# Altium project DeskDigitalClock.PrjPcb
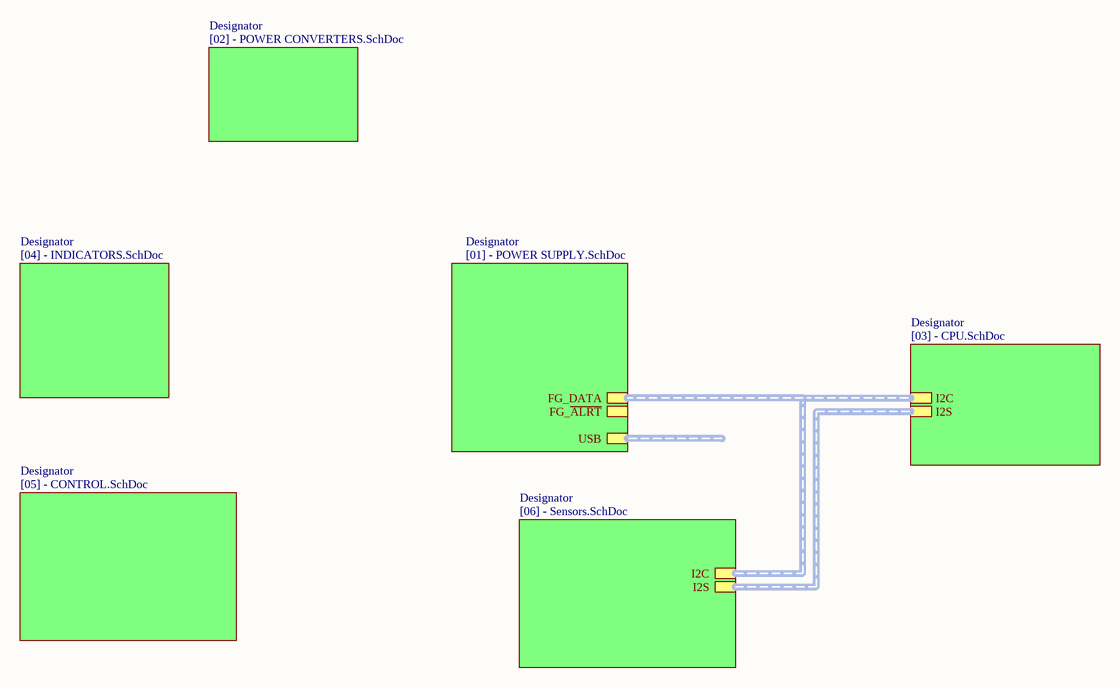
[diagram p0: [00] - BLOCK DIAGRAM.SchDoc]
7 sheets, 120 parts. Net scope: hierarchical (ports join the sheet entries above them; power ports are global).
Board file: DeskDigitalClock.PcbDoc
Sheets:
  [00] - BLOCK DIAGRAM.SchDoc
    Designator = [01] - POWER SUPPLY.SchDoc
    Designator = [02] - POWER CONVERTERS.SchDoc
    Designator = [03] - CPU.SchDoc
    Designator = [04] - INDICATORS.SchDoc
    Designator = [05] - CONTROL.SchDoc
    Designator = [06] - SENSORS.SchDoc

## Sheet [00] - BLOCK DIAGRAM.SchDoc: Desk Digital Clock
size A4; DrawnBy: Ramil Teregulov; Address1: https://github.com/teregulov; Address2: https://github.com/teregulov/Desk-Digital-Clock; DocumentNumber: DDC-1; Revision: 1R0; SheetNumber: 1; SheetTotal: 7

### Sub-sheets
Designator = [01] - POWER SUPPLY.SchDoc: FG_DATA, FG_~{ALRT}, USB
Designator = [02] - POWER CONVERTERS.SchDoc: no entries
Designator = [03] - CPU.SchDoc: I2C, I2S
Designator = [04] - INDICATORS.SchDoc: no entries
Designator = [05] - CONTROL.SchDoc: no entries
Designator = [06] - Sensors.SchDoc: I2C, I2S

### Buses and harness runs
harness sheet Designator/FG_DATA = sheet Designator/I2C

### Notes on the sheet
- Title:
- Size:
- Date:
- A4
- Number:
- Time:
- Revision:
- Sheet
- of
- File:

## Sheet [01] - POWER SUPPLY.SchDoc: Desk Digital Clock
size A2; DrawnBy: Ramil Teregulov; Address1: http://github.com/teregulov; Address2: http://github.com/teregulov/Desk-Digital-Clock; DocumentNumber: DDC-5; Revision: 1R0; SheetNumber: 5; SheetTotal: 7
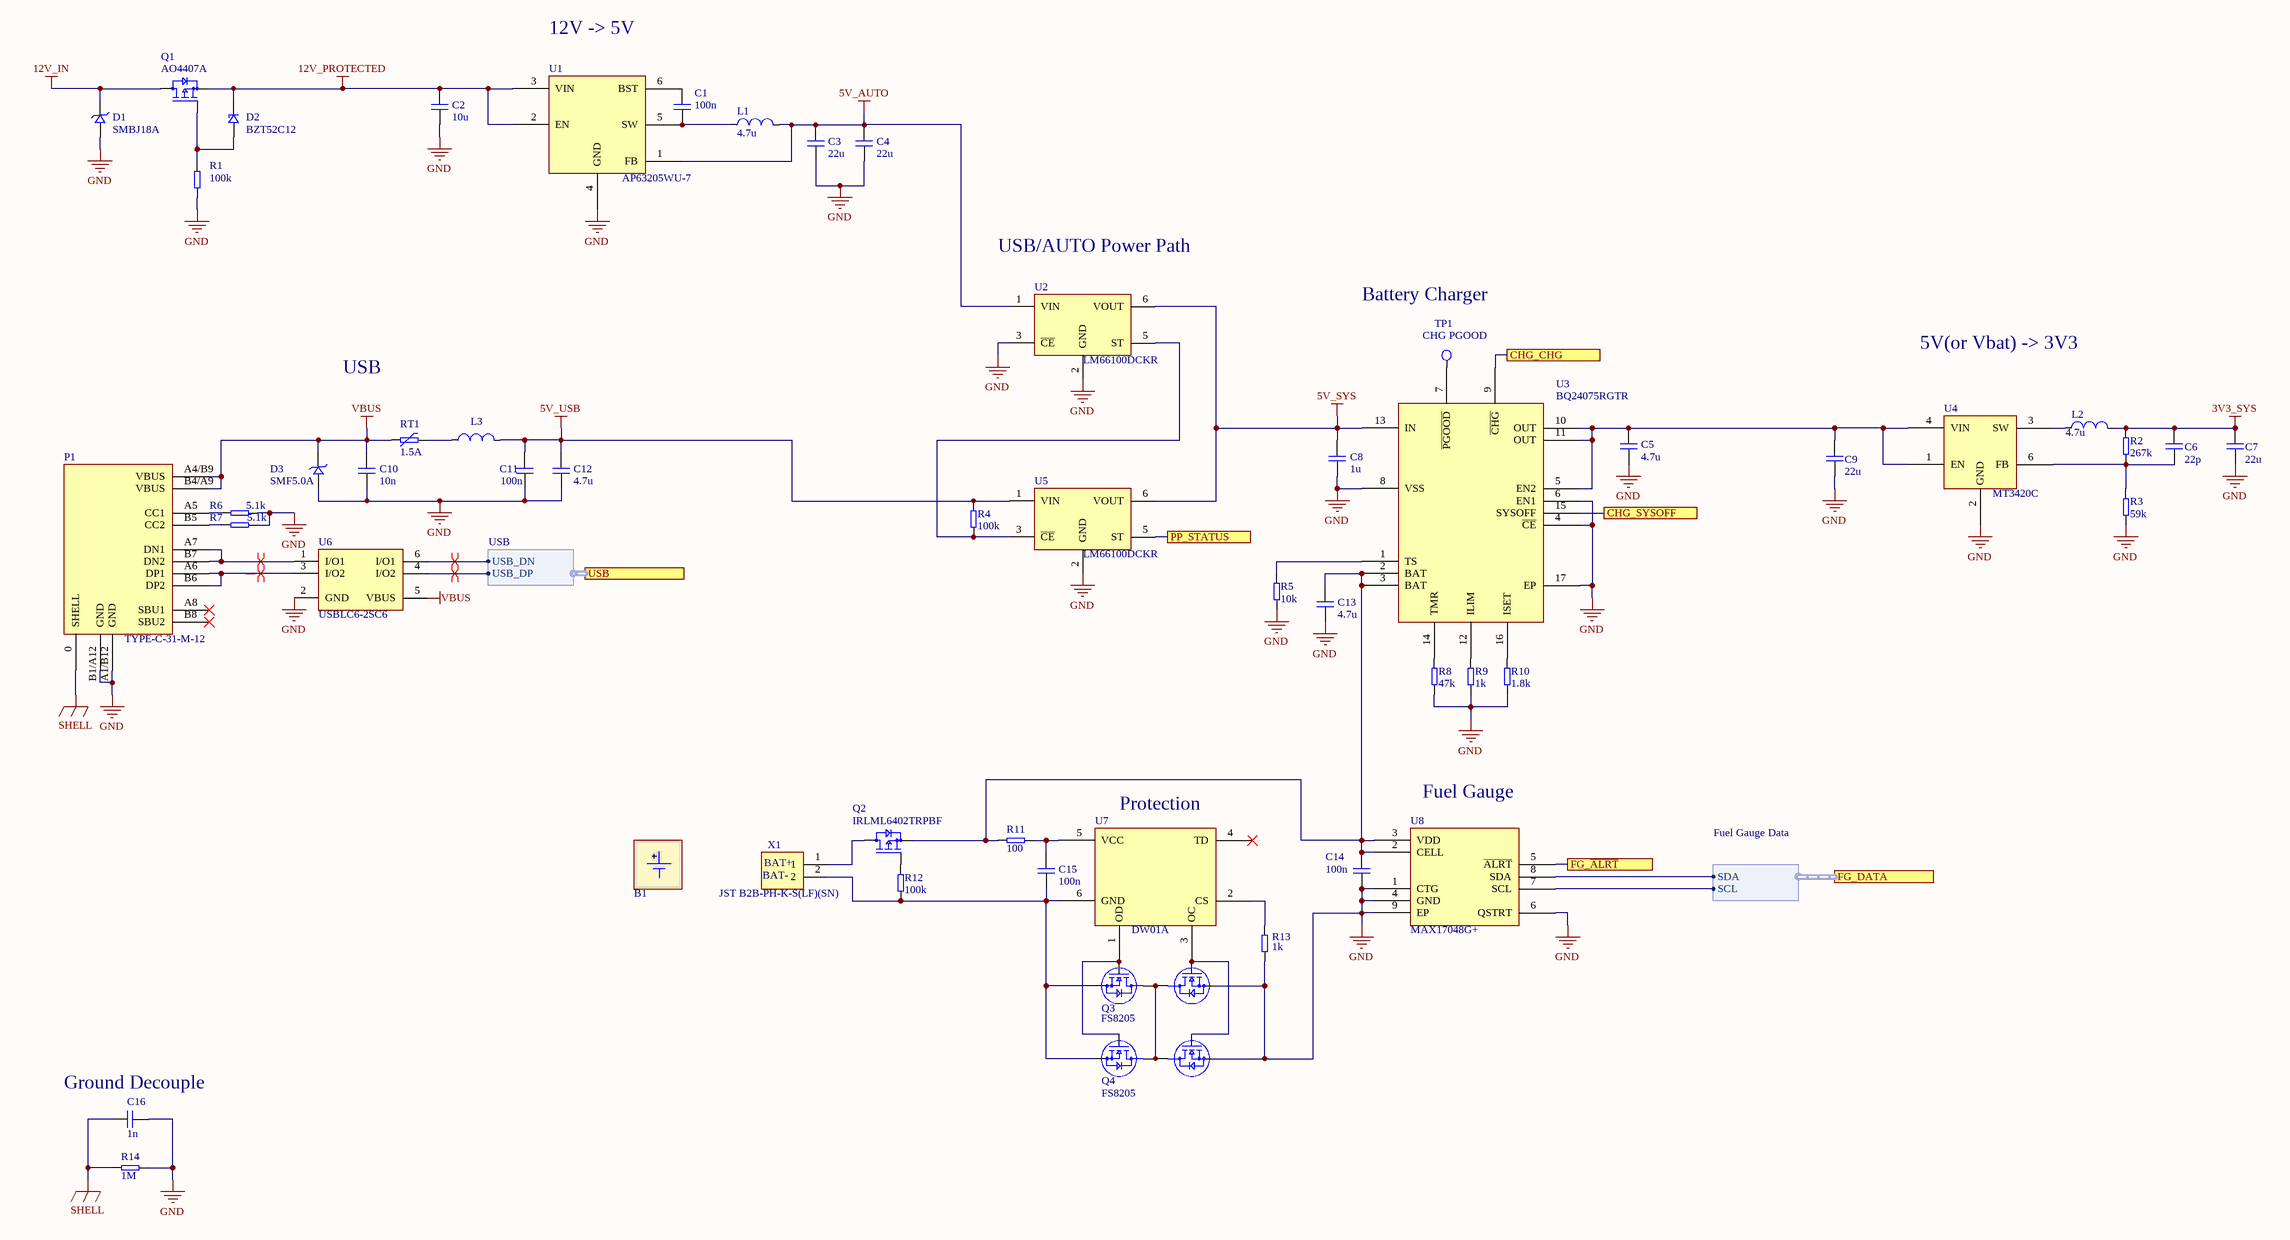
[diagram p1: [01] - POWER SUPPLY.SchDoc]

### Parts
(Parts that share a designator on the sheet are numbered #1, #2 ... from top to bottom, then left to right.)
B1  (no value)  (mechanical)
C1  100n  [C0603]
C2  10u  [C1206]
C3  22u  [C1206]
C4  22u  [C1206]
C5  4.7u  [C0603]
C6  22p  [C0603]
C7  22u  [C1210]
C8  1u  [C0603]
C9  22u  [C1210]
C10  10n  [C0603]
C11  100n  [C0603]
C12  4.7u  [C0603]
C13  4.7u  [C0603]
C14  100n  [C0603]
C15  100n  [C0603]
C16#1  1n  [C0603]
D1  SMBJ18A  [SMBJ18A]
D2#1  BZT52C12  [BZT52C12]
D3#1  SMF5.0A  [SSMF5.0A OD-123FL]
L1#1  4.7u  [GSM0530-xxx-M Inductor]
L2  4.7u  [CDRH5D16]
L3  (no value)  [C0805]
P1  TYPE-C-31-M-12  [TYPE-C-31-M-12]
Q1  AO4407A  [UMW AO4407A]
Q2  IRLML6402TRPBF  [IRLML6402TRPBF]
Q3  FS8205  [SOT23-6-MT3420C]
Q4  FS8205  [SOT23-6-MT3420C]
R1  100k  [R0603]
R2  267k  [R0603]
R3  59k  [R0603]
R4  100k  [R0603]
R5  10k  [R0603]
R6  5.1k  [R0603]
R7  5.1k  [R0603]
R8  47k  [R0603]
R9  1k  [R0603]
R10  1.8k  [R0603]
R11  100  [R0603]
R12  100k  [R0603]
R13  1k  [R0603]
R14  1M  [R0603]
RT1  value 1.5A  [MF-MSMF150]  (hidden comment: MF-MSMF150-2)
TP1  Test Point Name: CHG PGOOD  [Test Point 1.6 mm]  (hidden comment: Test Point)  (no BOM)
U1  AP63205WU-7  [TAP63200/AP63201/AP63203/AP63205 SOT26]
U2  LM66100DCKR  [LM66100DCKR]
U3  BQ24075RGTR  [BQ24072 BQ24073 BQ24074 BQ24075 BQ24079]
U4  MT3420C  [SOT23-6-MT3420C]
U5  LM66100DCKR  [LM66100DCKR]
U6#1  USBLC6-2SC6  [SOT23-6L-USBLC6-2SC6]
U7  DW01A  [SOT23-6-MT3420C]
U8  MAX17048G+  [MAXIM MAX17048G+T10]
X1  JST B2B-PH-K-S(LF)(SN)  [B2B -PH-K-S]

### Ports
CHG_CHG, CHG_SYSOFF, FG_DATA (harness Fuel Gauge Data), FG_~{ALRT}, PP_STATUS, USB (harness USB)

### Harnesses
Fuel Gauge Data: SDA, SCL
USB: USB_DP, USB_DN

### Nets
3V3_SYS: C6.2 C7.2 L2.2 R2.2
5V_AUTO: C3.2 C4.2 L1#1.2 U1.1(FB) U2.1(VIN)
5V_SYS: C8.2 U2.6(VOUT) U3.13(IN) U5.6(VOUT)
5V_USB: C11.2 C12.2 L3.2 R4.1 U5.1(VIN)
12V_IN: D1.1 Q1.D
12V_PROTECTED: C2.2 D2#1.1 Q1.S U1.2(EN) U1.3(VIN)
GND: C2.1 C3.1 C4.1 C5.1 C7.1 C8.1 C9.1 C10.1 C11.1 C12.1 C13.1 C14.1 C16#1.1 D1.2 D3#1.2 P1.A1/B12(GND) P1.B1/A12(GND) Q3.3(S2) Q4.3(S2) R1.2 R3.1 R5.2 R6.1 R7.1 R8.2 R9.2 R10.2 R13.1 R14.2 U1.4(GND) U2.2(GND) U2.3(~{CE}) U3.4(~{CE}) U3.6(EN1) U3.8(VSS) U3.17(EP) U4.2(GND) U5.2(GND) U6#1.2(GND) U8.1(CTG) U8.4(GND) U8.6(QSTRT) U8.9(EP)
SHELL: C16#1.2 P1.0(SHELL) R14.1
VBUS: C10.2 D3#1.1 P1.A4/B9(VBUS) P1.B4/A9(VBUS) RT1.1 U6#1.5(VBUS)
NetC1_1: C1.1 L1#1.1 U1.5(SW)
NetC1_2: C1.2 U1.6(BST)
NetC5_2: C5.2 C9.2 U3.5(EN2) U3.10(OUT) U3.11(OUT) U4.1(EN) U4.4(VIN)
NetC6_1: C6.1 R2.1 R3.2 U4.6(FB)
NetC13_2: C13.2 C14.2 Q2.2 R11.2 U3.2(BAT) U3.3(BAT) U8.2(CELL) U8.3(VDD)
NetC15_1: C15.1 Q3.1(S1) Q4.1(S1) R12.2 U7.6(GND) X1.2
NetC15_2: C15.2 R11.1 U7.5(VCC)
NetD2#1_2: D2#1.2 Q1.G R1.1
NetL2_1: L2.1 U4.3(SW)
NetL3_1: L3.1 RT1.2
NetP1_A5: P1.A5(CC1) R6.2
NetP1_A6: P1.A6(DP1) P1.B6(DP2) U6#1.3(I/O2)
NetP1_A7: P1.A7(DN1) P1.B7(DN2) U6#1.1(I/O1)
NetP1_B5: P1.B5(CC2) R7.2
NetQ2_1: Q2.1 R12.1
NetQ2_3: Q2.3 X1.1
NetQ3_2: Q3.2(D12) Q3.5(D12) Q4.2(D12) Q4.5(D12)
NetQ3_4: Q3.4(G2) Q4.4(G2) U7.3(OC)
NetQ3_6: Q3.6(G1) Q4.6(G1) U7.1(OD)
NetR4_2: R4.2 U2.5(ST) U5.3(~{CE})
NetR5_1: R5.1 U3.1(TS)
NetR8_1: R8.1 U3.14(TMR)
NetR9_1: R9.1 U3.12(ILIM)
NetR10_1: R10.1 U3.16(ISET)
NetR13_2: R13.2 U7.2(CS)
NetR25_1: U8.7(SCL) ; port FG_DATA.SCL
NetR26_1: U8.8(SDA) ; port FG_DATA.SDA
NetTP1_1: TP1.1 U3.7(~{PGOOD})
NetU3_9: U3.9(~{CHG}) ; port CHG_CHG
NetU3_15: U3.15(SYSOFF) ; port CHG_SYSOFF
NetU5_5: U5.5(ST) ; port PP_STATUS
NetU6#1_4: U6#1.4(I/O2) ; port USB.USB_DP
NetU6#1_6: U6#1.6(I/O1) ; port USB.USB_DN
NetU8_5: U8.5(~{ALRT}) ; port FG_~{ALRT}

Not connected (* = marked no-connect by the designer): P1 A8(SBU1)* B8(SBU2)*; U7 4(TD)*

### Layout directives
differential pair: NetP1_A6, NetP1_A7, NetU6#1_4, NetU6#1_6

### Notes on the sheet
- 12V -> 5V
- USB/AUTO Power Path
- Battery Charger
- USB
- 5V(or Vbat) -> 3V3
- (near U7) Protection
- (near U8) Fuel Gauge
- (near X1) BAT-
- (near X1) BAT+
- (near C16#1) Ground Decouple
- Title:
- Size:
- Date:
- A4
- Number:
- Time:
- Revision:
- Sheet
- of
- File:

### Library data of the parts
B1 = Bat: BATTERY
C1-C15 C16#1 = Cap: CAPACITOR
  C1 C11 C14 C15: Value: 100n
  C2: Value: 10u
  C3 C4 C7 C9: Value: 22u
  C5 C12 C13: Value: 4.7u
  C6: Value: 22p
  C8: Value: 1u
  C10: Value: 10n
  C16: Value: 1n
D1 = SMBJ18A: TVS DIODE 18VWM 29.2VC SMB; Manufacturer: Jingdao Microelectronics; HelpURL: https://www.lcsc.com/datasheet/C353379.pdf?spm=wm.sxq.inf.ggs___wm.fly.bg.1.xh&lcsc_vid=EQRaUgBURlNYUgcERQILVVIEQ1gIVldeRllcAwAFQQMxVlNeR1NcUFFVQVVWVDsOAxUeFF5JWBYZEEoKFBINSQcJGk4dAgUUFAk%3D; P/N: SMBJ18A
D2#1 = BZT52C12: DIODE ZENER 12V 500mW SOD-123; Manufacturer: GOODWORK; HelpURL: https://www.lcsc.com/datasheet/C2932744.pdf?spm=wm.sxq.inf.ggs___wm.fly.bg.1.xh&lcsc_vid=EQRaUgBURlNYUgcERQILVVIEQ1gIVldeRllcAwAFQQMxVlNeR1NcUVVQTlheVDsOAxUeFF5JWBYZEEoKFBINSQcJGk4eFQsCAgIaSgADAwAHC0slRVlaVlBeRU8GEwkK; P/N: BZT52C12
D3#1 = SMF5.0A: TVS DIODE 5VWM 9.2VC SOD-123FL; Manufacturer: Littelfuse; HelpURL: https://www.lcsc.com/datasheet/C151296.pdf?spm=wm.sxq.inf.ggs___wm.fly.bg.0.xh&lcsc_vid=EQRaUgBURlNYUgcERQILVVIEQ1gIVldeRllcAwAFQQMxVlNeR1BZVV1RTlhdVDsOAxUeFF5JWBYZEEoKFBINSQcJGk4NBhADEA4cHkteQ1NADxALGw%3D%3D; P/N: SMF5.0A
L1#1 = GSM0530-4R7-M: FIXED IND 4.7uH 4.5A 54mΩ SMD,5.7x5.2mm; P/N: GSM0530-4R7-M; HelpURL: https://www.lcsc.com/datasheet/C51933829.pdf?spm=wm.sxq.inf.ggs___wm.fly.bg.3.xh&lcsc_vid=EQRaUgBURlNYUgcERQILVVIEQ1gIVldeRllcAwAFQQMxVlNeR1NcVlZRQlBWXjsOAxUeFF5JWBYZEEoKFBINSQcJGk4eFQsCAgIaSgADAwAHC0slQlJaXlNWQk8GEwkK; Value: 4.7u
L2 = Ind: INDUCTOR; P/N: CDRH5D16NP-4R7NC; Value: 4.7u
L3 = Ind: Ferrite Bead; P/N: blm21pg221s
P1 = TYPE-C-31-M-12: CONN RCPT Type-C 16POS SMD; P/N: TYPE-C-31-M-12; HelpURL: https://www.lcsc.com/datasheet/C165948.pdf?spm=wm.sxq.inf.ggs___wm.fly.bg.0.xh&lcsc_vid=EQRaUgBURlNYUgcERQILVVIEQ1gIVldeRllcAwAFQQMxVlNeR1BYXlVUQlFaVjsOAxUeFF5JWBYZEEoKFBINSQcJGk4eFQsCAgIaSgADAwAHC0slRVNaUVNWTlZADxALGw%3D%3D
Q1 = AO4407A: MOSFET P-CH 30V 14A SOP-8; Manufacturer: UWM; P/N: AO4407A; Datasheet: https://www.lcsc.com/datasheet/C2841482.pdf?spm=wm.sxq.inf.ggs___wm.fly.bg.1.xh&lcsc_vid=EQRaUgBURlNYUgcERQILVVIEQ1gIVldeRllcAwAFQQMxVlNeR1NcU1xSQlJfVzsOAxUeFF5JWBYZEEoKFBINSQcJGk4eFQsCAgIaSgADAwAHC0slRldeUFZIHxUDCw%3D%3D; Package: SOP-8
Q2 = IRLML6402TRPBF: MOSFET P-CH 20V 3.7A SOT-23; Manufacturer: Infineon; P/N: IRLML6402TRPBF; Package: SOT-23
Q3 Q4 = FS8205: Dual n-Channel Enhancement Mode power MOSFET; Manufacturer: Fortune; P/N: FS8205; Datasheet: https://datasheet.lcsc.com/lcsc/1810110910_Fortune-Semicon-FS8205_C32254.pdf
R1-R14 = Res: RESISTOR
  R1 R4 R12: Value: 100k
  R2: Value: 267k
  R3: Value: 59k
  R5: Value: 10k
  R6 R7: Value: 5.1k
  R8: Value: 47k
  R9 R13: Value: 1k
  R10: Value: 1.8k
  R11: Value: 100
  R14: Value: 1M
RT1 = MF-MSMF150-2: PTC RESET FUSE 6V 1812; P/N: MF-MSMF150-2; ComponentLink1Description: HelpURL; ComponentLink1URL: https://www.lcsc.com/datasheet/C89648.pdf?spm=wm.sxq.inf.ggs___wm.fly.bg.0.xh&lcsc_vid=EQRaUgBURlNYUgcERQILVVIEQ1gIVldeRllcAwAFQQMxVlNeR1BZU1ReR1ldUTsOAxUeFF5JWBYZEEoKFBINSQcJGk4NBhADEA4cHktXR1BXSQwSGg0%3D
U1 = AP63205WU-7: 3.8V to 32V Input, 2A Low Quiescent Current Synchronous Buck Converter with Enhanced EMI Suppression; Manufacturer: DIODES; Datasheet: https://www.lcsc.com/datasheet/C2071056.pdf?spm=wm.sxq.inf.ggs___wm.fly.bg.0.xh&lcsc_vid=EQRaUgBURlNYUgcERQILVVIEQ1gIVldeRllcAwAFQQMxVlNeR1NfXlNVTlNXUDsOAxUeFF5JWBYZEEoKFBINSQcJGk4%3D; P/N: AP63205WU-7
U2 U5 = LM66100DCKR: Low IQ Ideal Diode With Input Polarity Protection; Manufacturer: TI; HelpURL: https://www.lcsc.com/datasheet/C2869734.pdf?spm=wm.sxq.inf.ggs___wm.fly.bg.0.xh&lcsc_vid=EQRaUgBURlNYUgcERQILVVIEQ1gIVldeRllcAwAFQQMxVlNeR1BZUlVeR1dfVzsOAxUeFF5JWBYZEEoKFBINSQcJGk4eFQsCAgIaSgADAwAHC0slT1hYU1xIHxUDCw%3D%3D; P/N: LM66100DCKR
U3 = BQ24075RGTR: 1.5A USB-FRIENDLY Li-lon BATTERY CHARGER AND POWER-PATH MANAGEMENT IC; Manufacturer: TI; HelpURL: https://www.lcsc.com/datasheet/C15464.pdf?spm=wm.sxq.inf.ggs___wm.fly.bg.0.xh&lcsc_vid=EQRaUgBURlNYUgcERQILVVIEQ1gIVldeRllcAwAFQQMxVlNeR1NcXlVXRlNaUzsOAxUeFF5JWBYZEEoKFBINSQcJGk4eFQsCAgIaSgADAwAHC0slQlFdUl1QWQkaCgg%3D; P/N: BQ24075RGTR
U4 = MT3420C: 2A 2.3-6V Input 1.5MHz Synchronous Step-Down Converter; Manufacturer: Aerosemi; Datasheet: https://datasheet.lcsc.com/lcsc/1806041635_XI-AN-Aerosemi-Tech-MT3420C_C181741.pdf; P/N: MT3420C
U6#1 = USBLC6-2SC6: TVS DIODE 5.25V 17V SOT23-6; Manufacturer: STMicroelectronics; Datasheet: https://www.st.com/content/ccc/resource/technical/document/datasheet/06/1d/48/9c/6c/20/4a/b2/CD00050750.pdf/files/CD00050750.pdf/jcr:content/translations/en.CD00050750.pdf; P/N: USBLC6-2SC6
U7 = DW01A: 2A 2.3-6V Input 1.5MHz Synchronous Step-Down Converter; Manufacturer: HMsemi; P/N: DW01A; HelpURL: https://hmsemi.com/downfile/DW01A.PDF
U8 = MAX17048G+T10: 1-Cell/2-Cell Fuel Gauge with ModelGauge; Manufacturer: Maxim Integrated; P/N: MAX17048G+; Datasheet: https://static.chipdip.ru/lib/542/DOC011542521.pdf
X1 = JST B2B-PH-K-S(LF)(SN): CONN HEADER TH 2POS 2mm; HelpURL: https://www.lcsc.com/datasheet/C131337.pdf?spm=wm.sxq.inf.ggs___wm.fly.bg.0.stp&lcsc_vid=FFBYBlcEFAQLVVJeQARWBFACRFUNUlFXRVlWBQJRRFkxVlNeR1NaVVVSQlRaUzsOAxUeFF5JWBYZEEoKFBINSQcJGk4dAgUUFAk%3D; Manufacturer: JST; P/N: JST B2B-PH-K-S(LF)(SN)

## Sheet [02] - POWER CONVERTERS.SchDoc: Desk Digital Clock
size A4; DrawnBy: Ramil Teregulov; Address1: http://github.com/teregulov; Address2: http://github.com/teregulov/Desk-Digital-Clock; DocumentNumber: DDC-7; Revision: 1R0; SheetNumber: 7; SheetTotal: 7
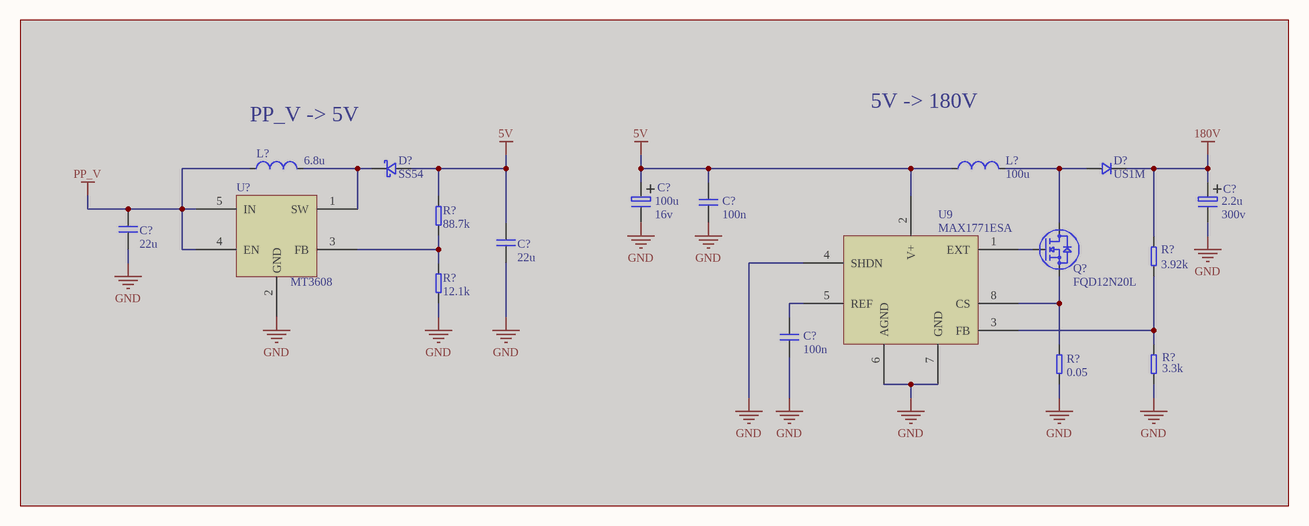
[diagram p2: [02] - POWER CONVERTERS.SchDoc]

### Parts
(Parts that share a designator on the sheet are numbered #1, #2 ... from top to bottom, then left to right.)
C16#2  Voltage: 16v  [CAPM3216X18N_TANTAL_E]  (hidden comment: 100u)  (masked out: inside a compile mask, not in the netlist)
C17#1  Voltage: 300v  [CAP_8X10.2]  (hidden comment: 2.2u)  (masked out: inside a compile mask, not in the netlist)
C21#1  22u  [C1210]  (masked out: inside a compile mask, not in the netlist)
C22#1  22u  [C1210]  (masked out: inside a compile mask, not in the netlist)
C23#1  100n  [C0603]  (masked out: inside a compile mask, not in the netlist)
C24#1  100n  [C0603]  (masked out: inside a compile mask, not in the netlist)
D2#2  P/N: SS54  [DIOM6959X26N-SS54]  (masked out: inside a compile mask, not in the netlist)
D3#2  (no value)  [DO-214AC(SMA)]  (masked out: inside a compile mask, not in the netlist)
L1#2  100u  [CD127-IND]  (masked out: inside a compile mask, not in the netlist)
L4#1  6.8u  [CDRH5D16]  (masked out: inside a compile mask, not in the netlist)
Q5  FQD12N20L  [DPAK-fqd12n20l]  (masked out: inside a compile mask, not in the netlist)
R16#1  88.7k  [R0603]  (masked out: inside a compile mask, not in the netlist)
R17#1  12.1k  [R0603]  (masked out: inside a compile mask, not in the netlist)
R18#1  3.92k  [R0603]  (masked out: inside a compile mask, not in the netlist)
R19#1  0.05  [R1206]  (masked out: inside a compile mask, not in the netlist)
R20#1  3.3k  [R0603]  (masked out: inside a compile mask, not in the netlist)
U6#2  MT3608  [SOT23-6-MT3420C]  (masked out: inside a compile mask, not in the netlist)
U9  MAX1771ESA  [MAX1771ESA]

### Nets

Not connected (* = marked no-connect by the designer): U9 1(EXT) 2(V+) 3(FB) 4(SHDN) 5(REF) 6(AGND) 7(GND) 8(CS)

### Notes on the sheet
- PP_V -> 5V
- 5V -> 180V
- Title:
- Size:
- Date:
- A4
- Number:
- Time:
- Revision:
- Sheet
- of
- File:

### Library data of the parts
C16#2 C17#1 = Cap_p: CAPACITOR
C21#1 C22#1 C23#1 C24#1 = Cap: CAPACITOR
D2#2 = Diode_Shottky: Diode Shottky
D3#2 = US1M: 1.0A SURFACE MOUNT ULTRA-FAST RECTIFIER; Manufacturer: Vishay
L1#2 = Ind: INDUCTOR
L4#1 = Ind: INDUCTOR; P/N: CDRH5D16NP-680MC
Q5 = FQD12N20L: n-Channel QFET MOSFET 200V 9A 280mOhm; Manufacturer: Fairchild Semiconductor
R16#1 R17#1 R18#1 R19#1 R20#1 = Res: RESISTOR
U6#2 = MT3608: High Efficiency 1.2MHz 2A Step Up Converter; Manufacturer: Aerosemi
U9 = MAX1771ESA: 12V or Adjustable, High-Efficiency, / Low IQ, Step-Up DC-DC Controller; Manufacturer: Maxim; Datasheet: https://static.chipdip.ru/lib/300/DOC000300892.pdf; P/N: MAX1771ESA

## Sheet [03] - CPU.SchDoc: Desk Digital Clock
size A4; DrawnBy: Ramil Teregulov; Address1: https://github.com/teregulov; Address2: https://github.com/teregulov/Desk-Digital-Clock; DocumentNumber: DDC-2; Revision: 1R0; SheetNumber: 2; SheetTotal: 7
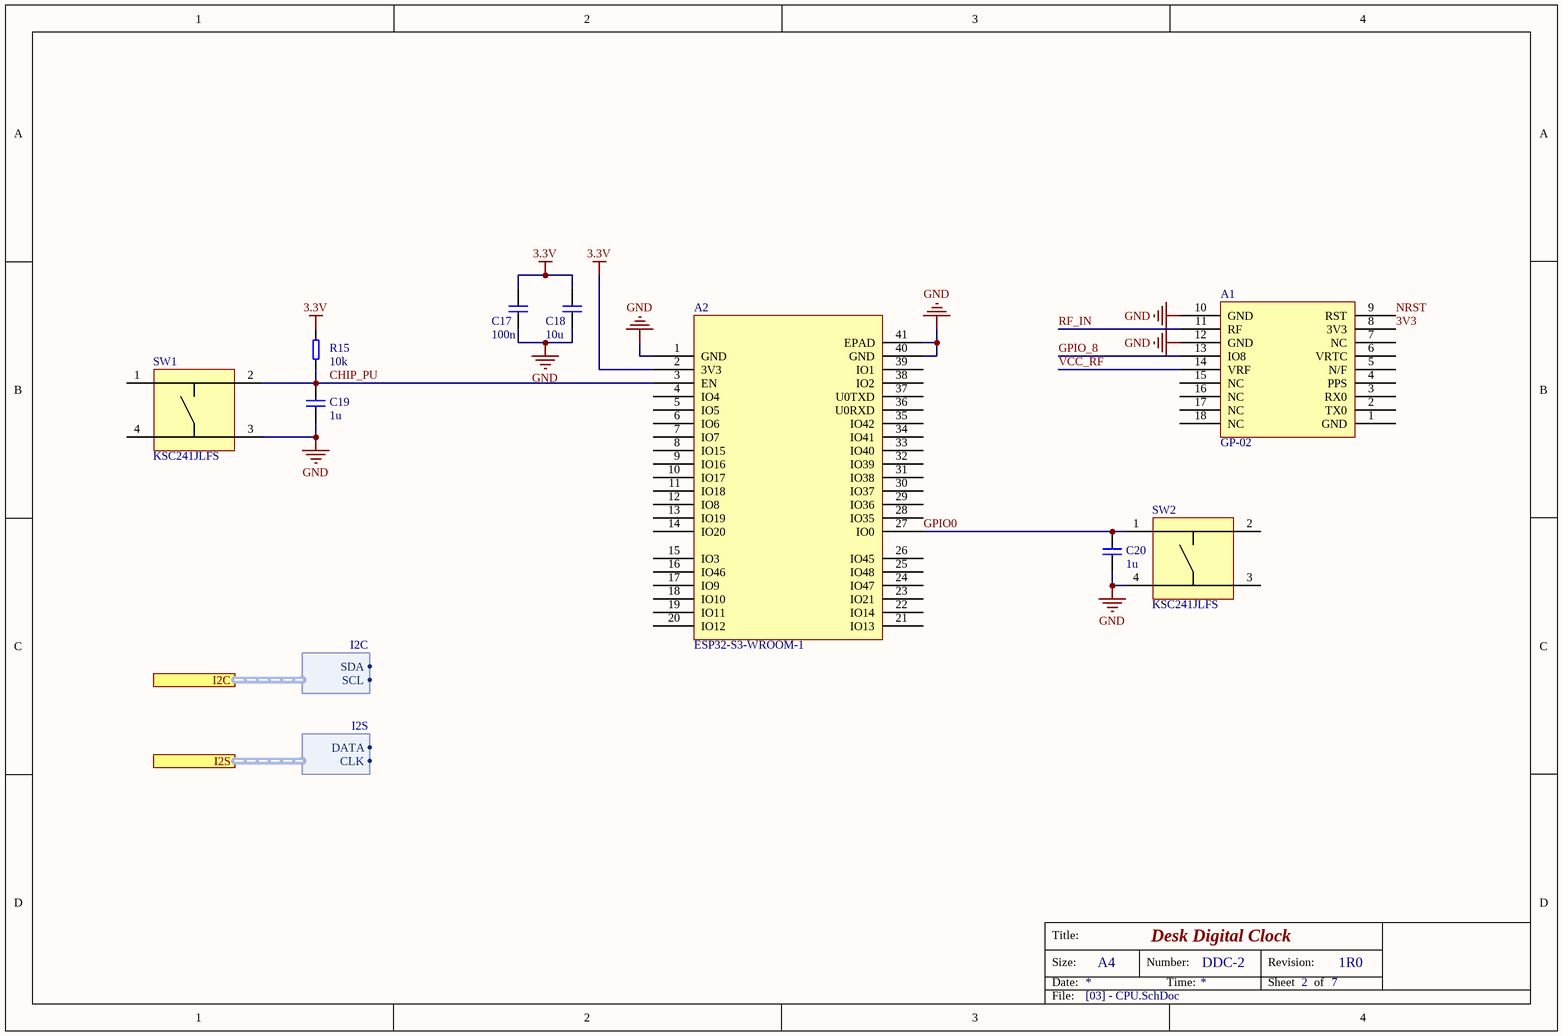
[diagram p3: [03] - CPU.SchDoc]

### Parts
(Parts that share a designator on the sheet are numbered #1, #2 ... from top to bottom, then left to right.)
A1  GP-02  [GP-02]
A2  ESP32-S3-WROOM-1  [ESP32-S3-WROOM-1]
C17#2  100n  [C0603]
C18  10u  [C0603]
C19  1u  [C0603]
C20  1u  [C0603]
R15  10k  [R0603]
SW1  KSC241JLFS  [KSC241JLFS]
SW2  KSC241JLFS  [KSC241JLFS]

### Ports
I2C (harness I2C), I2S (harness I2S)

### Harnesses
I2C: SDA, SCL
I2S: DATA, CLK

### Nets
3.3V: A2.2(3V3) C17#2.1 C18.1 R15.2
GND: A1.10(GND) A1.12(GND) A2.1(GND) A2.40(GND) A2.41(EPAD) C17#2.2 C18.2 C19.2 C20.2 SW1.3 SW2.4
3V3: A1.8(3V3)
CHIP_PU: A2.3(EN) C19.1 R15.1 SW1.2
GPIO0: A2.27(IO0) C20.1 SW2.1
GPIO_8: A1.13(IO8)
NRST: A1.9(RST)
RF_IN: A1.11(RF)
VCC_RF: A1.14(VRF)

Not connected (* = marked no-connect by the designer): A1 1(GND) 2(TX0) 3(RX0) 4(PPS) 5(N/F) 6(VRTC) 7(NC) 15(NC) 16(NC) 17(NC) 18(NC); A2 4(IO4) 5(IO5) 6(IO6) 7(IO7) 8(IO15) 9(IO16) 10(IO17) 11(IO18) 12(IO8) 13(IO19) 14(IO20) 15(IO3) 16(IO46) 17(IO9) 18(IO10) 19(IO11) 20(IO12) 21(IO13) 22(IO14) 23(IO21) 24(IO47) 25(IO48) 26(IO45) 28(IO35) 29(IO36) 30(IO37) 31(IO38) 32(IO39) 33(IO40) 34(IO41) 35(IO42) 36(U0RXD) 37(U0TXD) 38(IO2) 39(IO1); SW1 1 4; SW2 2 3

### Notes on the sheet
- Title:
- Size:
- Date:
- A4
- Number:
- Time:
- Revision:
- Sheet
- of
- File:

### Library data of the parts
A1 = GP-02: high-performance BDS/GNSS multi-mode satellite navigation receiver SOCmodule; Manufacturer: Ai Thinker; Datasheet: https://aithinker-static.oss-cn-shenzhen.aliyuncs.com/docs/_media_old/gp-02_specification.pdf; P/N: GP-02
A2 = ESP32-S3-WROOM-1: 2.4 GHz Wi-Fi (802.11 b/g/n) and Bluetooth® 5 (LE) module; Manufacturer: espressif; Datasheet: https://www.espressif.com/sites/default/files/documentation/esp32-s3-wroom-1_wroom-1u_datasheet_en.pdf; P/N: ESP32-S3-WROOM-1
C17#2 C18-C20 = Cap: CAPACITOR
  C17: Value: 100n
  C18: Value: 10u
  C19 C20: Value: 1u
R15 = Res: RESISTOR; Value: 10k
SW1 SW2 = KSC241JLFS: SWITCH TACTILE SPST-NO 50mA @ 32VDC; Manufacturer: C&K; P/N: KSC241JLFS; Datasheet: https://www.ckswitches.com/media/1968/ksc2.pdf

## Sheet [04] - INDICATORS.SchDoc: Desk Digital Clock
size A4; DrawnBy: Ramil Teregulov; Address1: http://github.com/teregulov; Address2: http://github.com/teregulov/Desk-Digital-Clock; DocumentNumber: DDC-3; Revision: 1R0; SheetNumber: 3; SheetTotal: 7
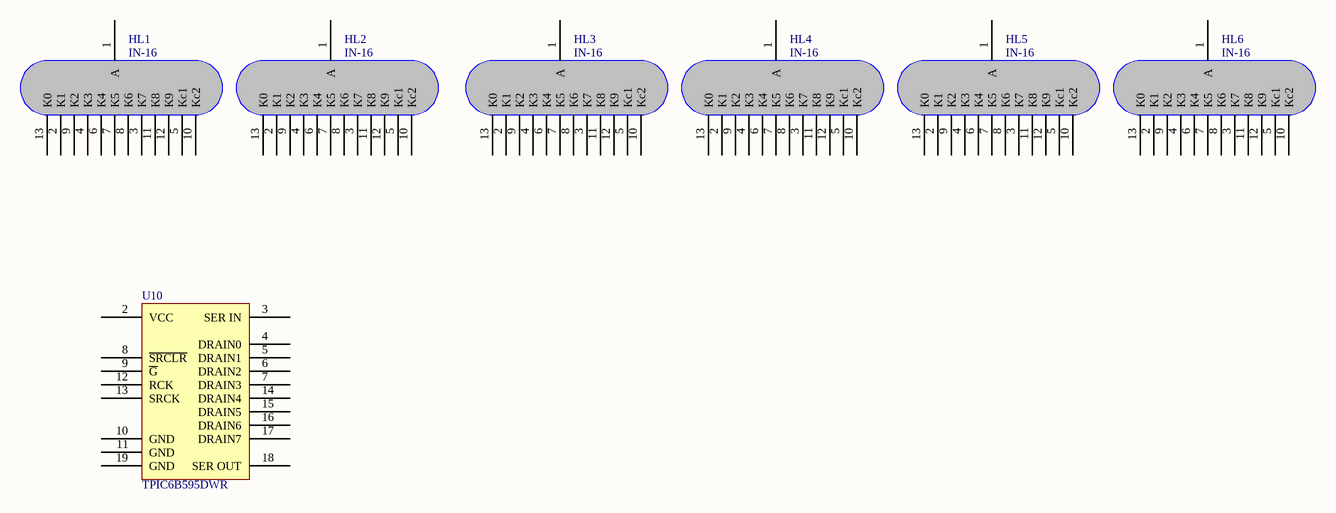
[diagram p4: [04] - INDICATORS.SchDoc]

### Parts
HL1  IN-16  [IN-16]
HL2  IN-16  [IN-16]
HL3  IN-16  [IN-16]
HL4  IN-16  [IN-16]
HL5  IN-16  [IN-16]
HL6  IN-16  [IN-16]
U10  TPIC6B595DWR  [SOP127P1030X265-20N]

### Nets

Not connected (* = marked no-connect by the designer): HL1 1(A) 2(K1) 3(K7) 4(K3) 5(Kc1) 6(K4) 7(K5) 8(K6) 9(K2) 10(Kc2) 11(K8) 12(K9) 13(K0); HL2 1(A) 2(K1) 3(K7) 4(K3) 5(Kc1) 6(K4) 7(K5) 8(K6) 9(K2) 10(Kc2) 11(K8) 12(K9) 13(K0); HL3 1(A) 2(K1) 3(K7) 4(K3) 5(Kc1) 6(K4) 7(K5) 8(K6) 9(K2) 10(Kc2) 11(K8) 12(K9) 13(K0); HL4 1(A) 2(K1) 3(K7) 4(K3) 5(Kc1) 6(K4) 7(K5) 8(K6) 9(K2) 10(Kc2) 11(K8) 12(K9) 13(K0); HL5 1(A) 2(K1) 3(K7) 4(K3) 5(Kc1) 6(K4) 7(K5) 8(K6) 9(K2) 10(Kc2) 11(K8) 12(K9) 13(K0); HL6 1(A) 2(K1) 3(K7) 4(K3) 5(Kc1) 6(K4) 7(K5) 8(K6) 9(K2) 10(Kc2) 11(K8) 12(K9) 13(K0); U10 2(VCC) 3(SER_IN) 4(DRAIN0) 5(DRAIN1) 6(DRAIN2) 7(DRAIN3) 8(~{SRCLR}) 9(~{G}) 10(GND) 11(GND) 12(RCK) 13(SRCK) 14(DRAIN4) 15(DRAIN5) 16(DRAIN6) 17(DRAIN7) 18(SER_OUT) 19(GND)

### Notes on the sheet
- Title:
- Size:
- Date:
- A4
- Number:
- Time:
- Revision:
- Sheet
- of
- File:

### Library data of the parts
U10 = TPIC6B595DWR: Power Logic 8-Bit Shift Register; Manufacturer: Texas Instruments; Datasheet: https://static.chipdip.ru/lib/542/DOC012542376.pdf; P/N: TPIC6B595DWR
HL1-HL6 = IN-16: P/N: IN-16

## Sheet [05] - CONTROL.SchDoc: Desk Digital Clock
size A4; DrawnBy: Ramil Teregulov; Address1: http://github.com/teregulov; Address2: http://github.com/teregulov/Desk-Digital-Clock; DocumentNumber: DDC-4; Revision: 1R0; SheetNumber: 4; SheetTotal: 7
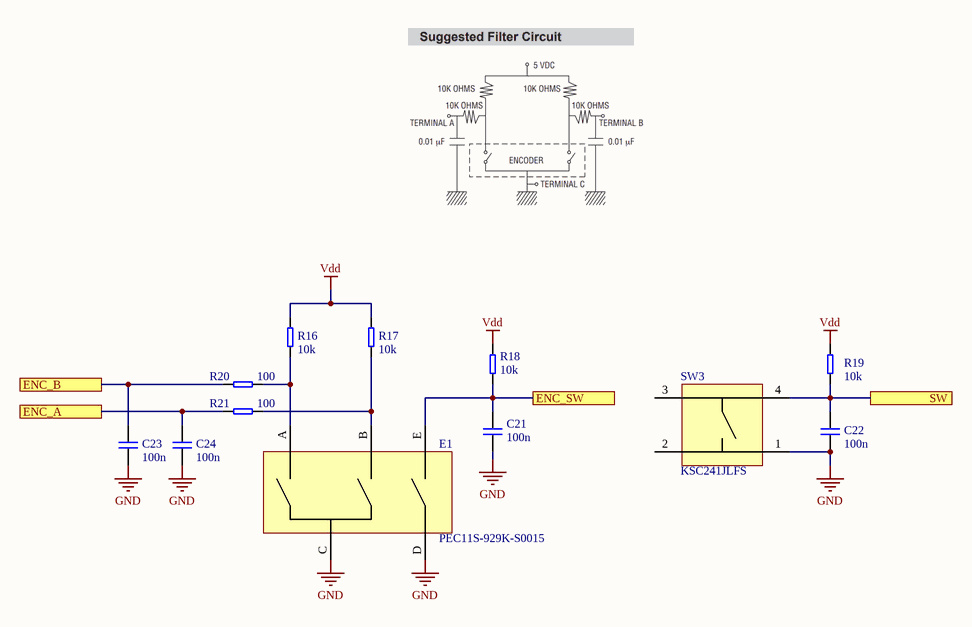
[diagram p5: [05] - CONTROL.SchDoc]

### Parts
(Parts that share a designator on the sheet are numbered #1, #2 ... from top to bottom, then left to right.)
C21#2  100n  [C0603]
C22#2  100n  [C0603]
C23#2  100n  [C0603]
C24#2  100n  [C0603]
E1  PEC11S-929K-S0015  [PEC11S-929K-S0015]
R16#2  10k  [R0603]
R17#2  10k  [R0603]
R18#2  10k  [R0603]
R19#2  10k  [R0603]
R20#2  100  [R0603]
R21  100  [R0603]
SW3  KSC241JLFS  [KSC241JLFS]

### Ports
ENC_A, ENC_B, ENC_SW, SW

### Nets
GND: C21#2.1 C22#2.1 C23#2.1 C24#2.1 E1.C E1.D SW3.1
Vdd: R16#2.2 R17#2.2 R18#2.2 R19#2.2
NetC21#2_2: C21#2.2 E1.E R18#2.1 ; port ENC_SW
NetC22#2_2: C22#2.2 R19#2.1 SW3.4 ; port SW
NetC23#2_2: C23#2.2 R20#2.2 ; port ENC_B
NetC24#2_2: C24#2.2 R21.2 ; port ENC_A
NetE1_A: E1.A R16#2.1 R20#2.1
NetE1_B: E1.B R17#2.1 R21.1

Not connected (* = marked no-connect by the designer): SW3 2 3

### Notes on the sheet
- Title:
- Size:
- Date:
- A4
- Number:
- Time:
- Revision:
- Sheet
- of
- File:

### Library data of the parts
C21#2 C22#2 C23#2 C24#2 = Cap: CAPACITOR; Value: 100n
E1 = PEC11S-929K-S0015: ROTARY ENCODER MECHANICAL 15PPR; Manufacturer: Bourns; P/N: PEC11S-929K-S0015; Datasheet: https://www.bourns.com/docs/product-datasheets/pec11s.pdf?sfvrsn=601089f1_5; Supplier 1: Aliexpress; Supplier Part Number 1: https://ru.aliexpress.com/item/32982414097.html?spm=a2g0o.productlist.0.0.66c8dd40JI3Wx0&algo_pvid=9a118981-c070-4602-89dc-e0076a1d9175&algo_expid=9a118981-c070-4602-89dc-e0076a1d9175-0&btsid=fce86d33-42b5-41e8-9f27-e9f4b1b87b22&ws_ab_test=searchweb0_0,searchweb201602_7,searchweb201603_52
R16#2 R17#2 R18#2 R19#2 R20#2 R21 = Res: RESISTOR
  R16-R19: Value: 10k
  R20 R21: Value: 100
SW3 = KSC241JLFS: as SW1 on sheet [03] - CPU; P/N: KSC241JLFS; Datasheet: https://www.ckswitches.com/media/1968/ksc2.pdf

## Sheet [06] - SENSORS.SchDoc
size A4
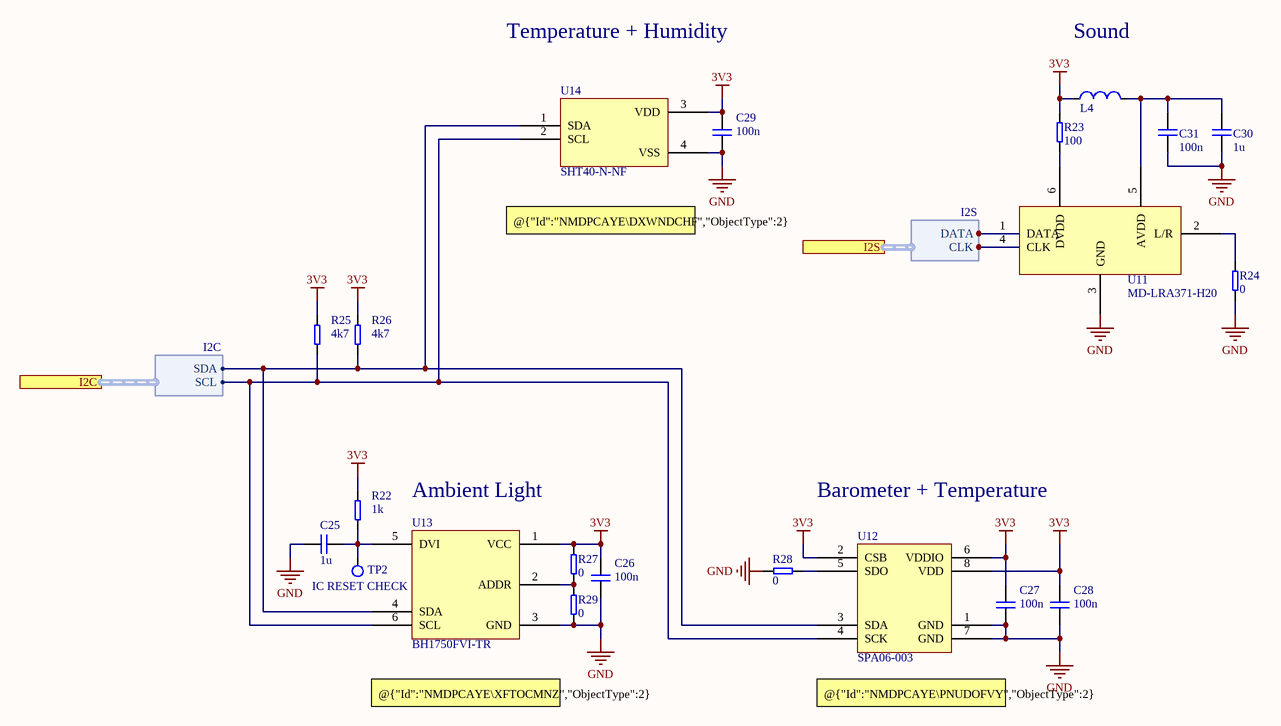
[diagram p6: [06] - SENSORS.SchDoc]

### Parts
(Parts that share a designator on the sheet are numbered #1, #2 ... from top to bottom, then left to right.)
C25  1u  [C0603]
C26  100n  [C0603]
C27  100n  [C0603]
C28  100n  [C0603]
C29  100n  [C0603]
C30  1u  [C0603]
C31  100n  [C0603]
L4#2  (no value)  [C0805]
R22  1k  [R0603]
R23  100  [R0603]
R24  0  [R0603]
R25  4k7  [R0603]
R26  4k7  [R0603]
R27  0  [R0603]
R28  0  [R0603]
R29  0  [R0603]
TP2  Test Point Name: IC RESET CHECK  [Test Point 1.6 mm]  (hidden comment: Test Point)  (no BOM)
U11  MD-LRA371-H20  [MD-LRA371-H20]
U12  SPA06-003  [SPA06-003]
U13  BH1750FVI-TR  [BH1750FVI-TR]
U14  SHT40-N-NF  [SHT40-N-NF]

### Ports
I2C (harness I2C), I2S (harness I2S)

### Harnesses
I2C: SDA, SCL
I2S: DATA, CLK

### Nets
3V3: C26.2 C27.2 C28.2 C29.2 L4#2.1 R22.2 R23.2 R25.2 R26.2 R27.2 U12.2(CSB) U12.6(VDDIO) U12.8(VDD) U13.1(VCC) U14.3(VDD)
GND: C25.2 C26.1 C27.1 C28.1 C29.1 C30.2 C31.1 R24.1 R28.1 R29.1 U11.3(GND) U12.1(GND) U12.7(GND) U13.3(GND) U14.4(VSS)
NetC25_1: C25.1 R22.1 TP2.1 U13.5(DVI)
NetC30_1: C30.1 C31.2 L4#2.2 U11.5(AVDD)
NetR23_1: R23.1 U11.6(DVDD)
NetR24_2: R24.2 U11.2(L/R)
NetR25_1: R25.1 U12.4(SCK) U13.6(SCL) U14.2(SCL) ; port I2C.SCL
NetR26_1: R26.1 U12.3(SDA) U13.4(SDA) U14.1(SDA) ; port I2C.SDA
NetR27_1: R27.1 R29.2 U13.2(ADDR)
NetR28_2: R28.2 U12.5(SDO)
NetU11_1: U11.1(DATA) ; port I2S.DATA
NetU11_4: U11.4(CLK) ; port I2S.CLK

### Notes on the sheet
- Temperature + Humidity
- Sound
- @{"Id":"NMDPCAYE\DXWNDCHF","ObjectType":2} I2C ADDRESS: “ 0x44“
- Ambient Light
- Barometer + Temperature
- @{"Id":"NMDPCAYE\XFTOCMNZ","ObjectType":2} I2C ADDRESS: “0100011“
- (near U12) @{"Id":"NMDPCAYE\PNUDOFVY","ObjectType":2} I2C ADDRESS: “ 0x77“

### Library data of the parts
C25-C31 = Cap: CAPACITOR
  C25 C30: Value: 1u
  C26-C29 C31: Value: 100n
L4#2 = Ind: Ferrite Bead; P/N: blm21pg221s
R22-R29 = Res: RESISTOR
  R22: Value: 1k
  R23: Value: 100
  R24 R27-R29: Value: 0
  R25 R26: Value: 4k7
U11 = MD-LRA371-H20: Omnidirectional -37dB 65dB SMD Microphones RoHS; Manufacturer: Gettop; HelpURL: https://www.lcsc.com/datasheet/C50275770.pdf?spm=wm.sxq.inf.ggs___wm.fly.bg.3.xh&lcsc_vid=FFBYBlcEFAQLVVJeQARWBFACRFUNUlFXRVlWBQJRRFkxVlNeR1RWXldUQ1RdUTsOAxUeFF5JWBYZEEoKFBINSQcJGk4eFQsCAgIaSgADAwAHC0slQldbUVJXR08GEwkK; P/N: MD-LRA371-H20
U12 = SPA06-003: LGA-8(2x2.5) Digital pressure sensor; Manufacturer: Goertek; HelpURL: https://www.lcsc.com/datasheet/C30589048.pdf?spm=wm.sxq.inf.ggs&lcsc_vid=EQRaUgBURlNYUgcERQILVVIEQ1gIVldeRllcAwAFQQMxVlNeR1RWU1JeQFRdUjsOAxUeFF5JWBYZEEoBGA4JCwFIFA4DSA%3D%3D; P/N: SPA06-003
U13 = BH1750FVI-TR: WSOF-6 Ambient Light Sensor IC; Manufacturer: ROHM; HelpURL: https://www.lcsc.com/datasheet/C78960.pdf?spm=wm.sxq.inf.ggs___wm.fly.bg.0.xh&lcsc_vid=FFBYBlcEFAQLVVJeQARWBFACRFUNUlFXRVlWBQJRRFkxVlNeR1RWUFZeRlheVTsOAxUeFF5JWBYZEEoKFBINSQcJGk4NBhADEA4cHktXQ1VaSQwSGg0%3D; P/N: BH1750FVI-TR
U14 = SHT40-N-NF: DFN-4(1.5x1.5) Humidity, Moisture Sensors RoHS; Manufacturer: Nyfea; HelpURL: https://www.lcsc.com/datasheet/C54946589.pdf?spm=wm.sxq.inf.ggs___wm.fly.bg.0.xh&lcsc_vid=FFBYBlcEFAQLVVJeQARWBFACRFUNUlFXRVlWBQJRRFkxVlNeR1RWVVxXRlddVTsOAxUeFF5JWBYZEEoKFBINSQcJGk4dAgUUFAk%3D; P/N: SHT40-N-NF

## Nets that join several sheets
GND: [01] - POWER SUPPLY (43 pins), [03] - CPU (11 pins), [05] - CONTROL (7 pins), [06] - SENSORS (15 pins)
NetR25_1: [01] - POWER SUPPLY (U8.7), [06] - SENSORS (R25.1 U12.4 U13.6 U14.2)
NetR26_1: [01] - POWER SUPPLY (U8.8), [06] - SENSORS (R26.1 U12.3 U13.4 U14.1)

## Assembly variants
Base: not fitted R? R?